# Altium schematic sheet 主控制器.SchDoc
size A3; Organization: Altium Limited; Address1: L3, 12a Rodborough Rd; Address2: Frenchs Forest; Address3: NSW; Address4: Australia 2086
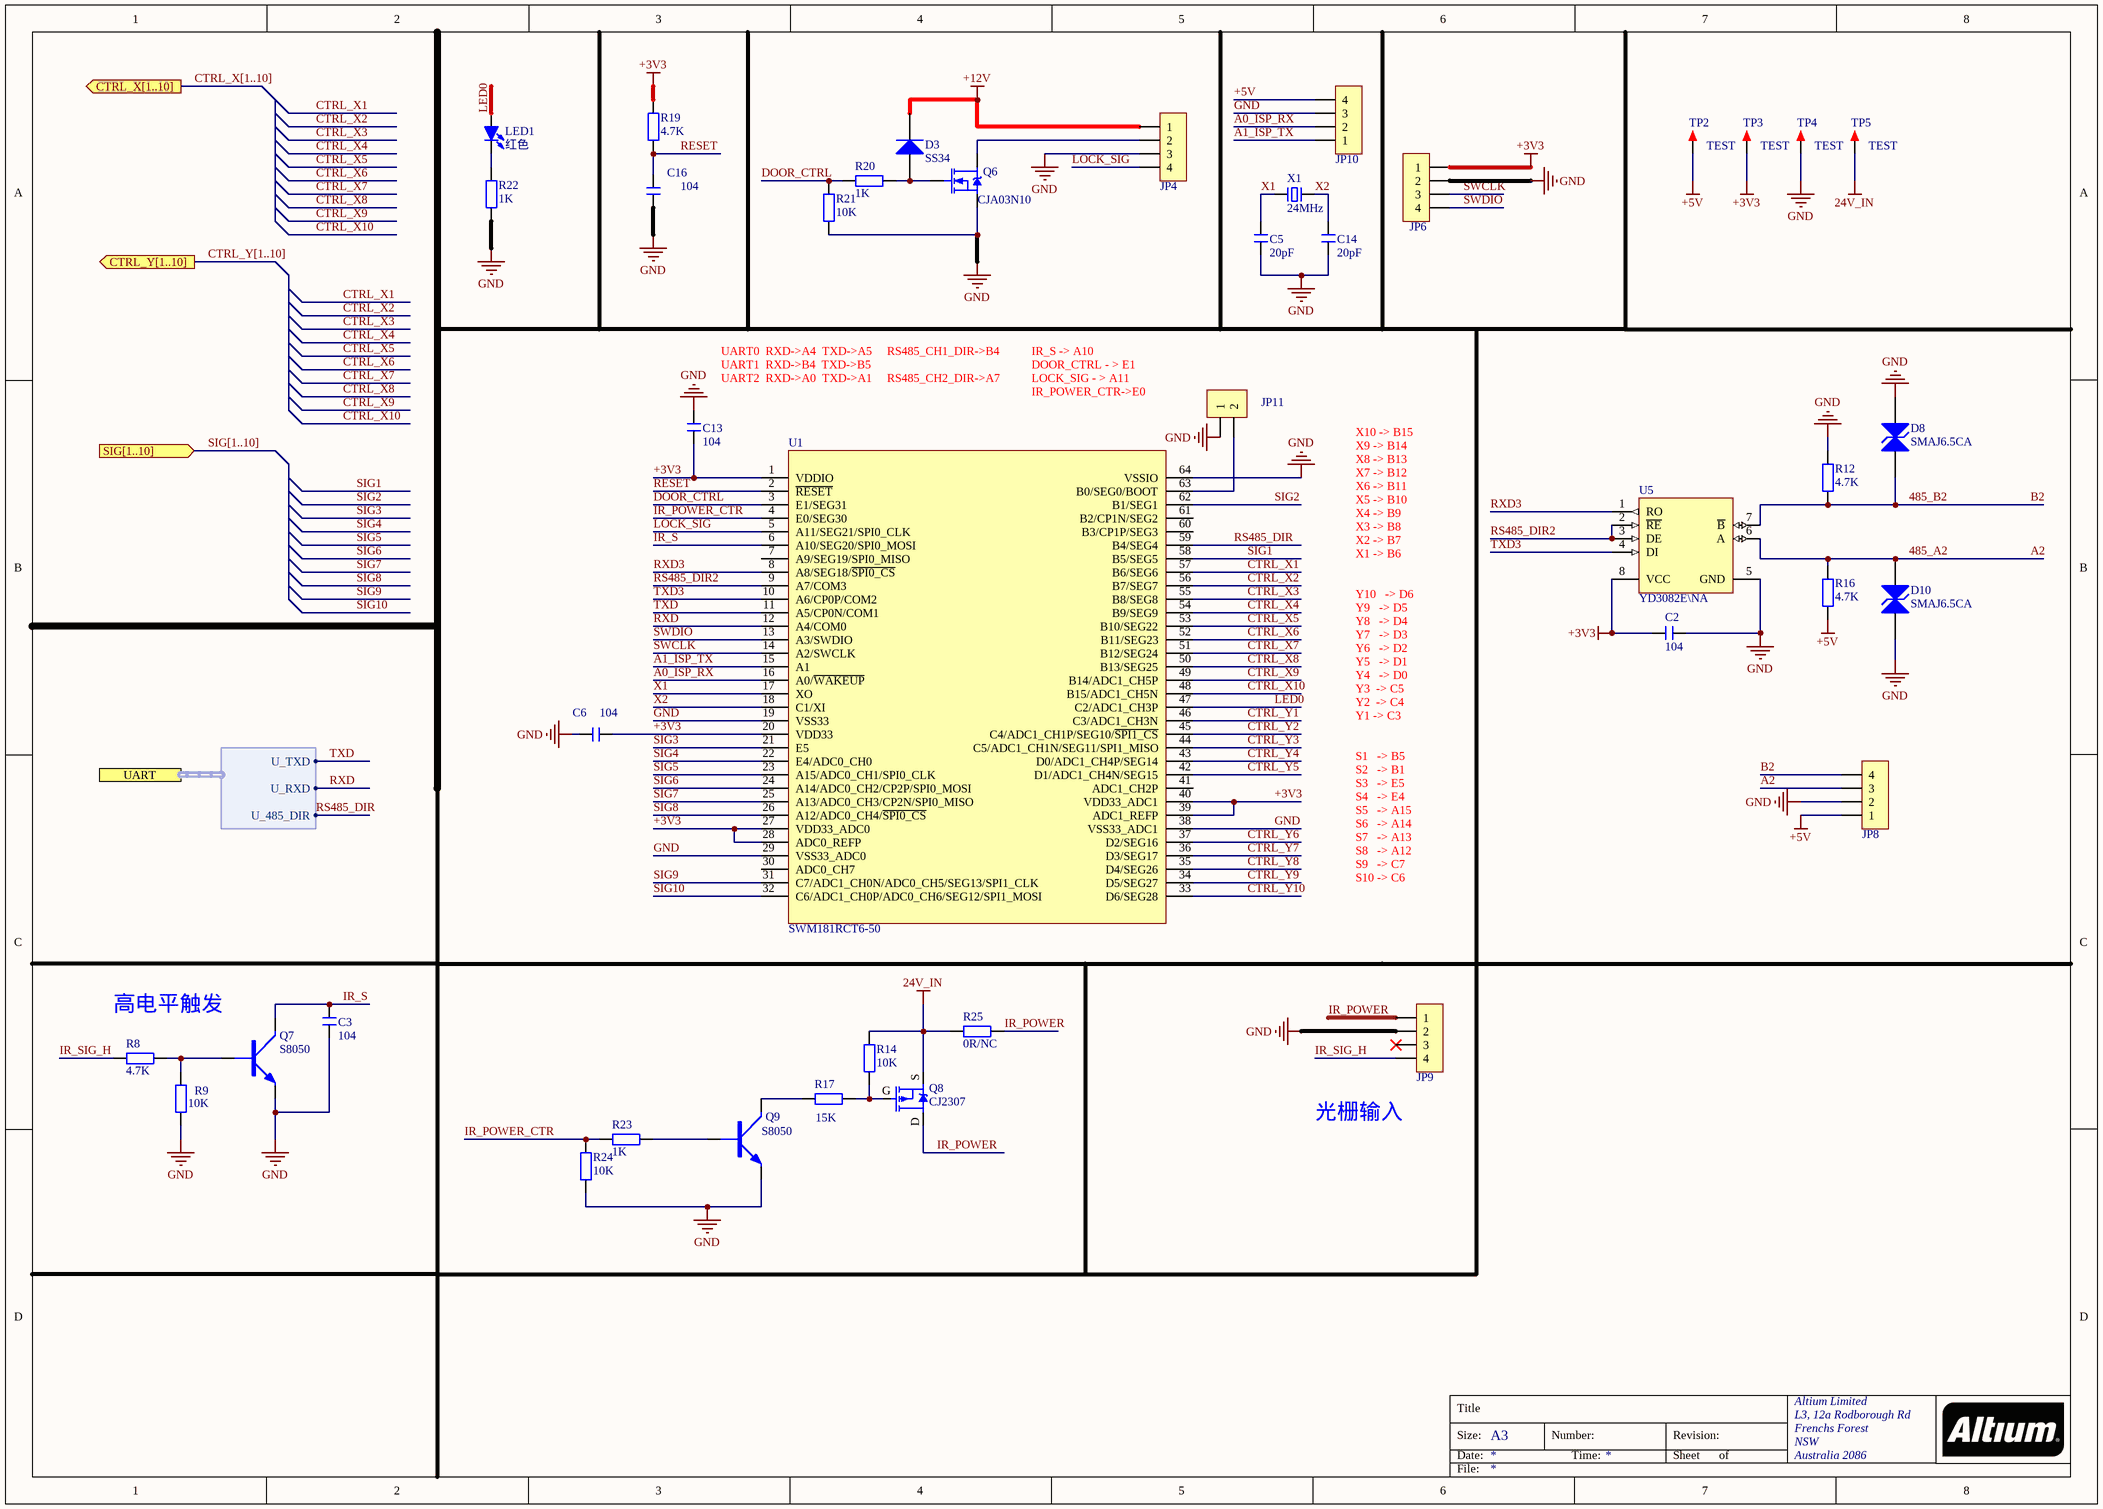
[diagram p0: 主控制器.SchDoc]

## Parts
C2  104  [C 0603]
C3  104  [C 0603]
C5  20pF  [C 0603]
C6  104  [C 0603]
C13  104  [C 0603]
C14  20pF  [C 0603]
C16  104  [C 0603]
D3  SS34  [SMA(DO-214AC)_S1]
D8  SMAJ6.5CA  [SMA(DO-214AC)_S1]
D10  SMAJ6.5CA  [SMA(DO-214AC)_S1]
JP4  XH-2.54-4P  [XH2.54-4P]  (value not drawn)
JP6  HDR-1X4  [HDR-1X4]  (value not drawn)
JP8  XH-2.54-4P  [XH2.54-4P]  (value not drawn)
JP9  HDR-1X4  [XH2.54-4P]  (value not drawn)
JP10  XH-2.54-4P  [XH2.54-4P]  (value not drawn)
JP11  HDR-1X2  [HDR-1X2]  (value not drawn)
LED1  红色  [LED 0603G]
Q6  CJA03N10  [LC-SOT-89(SOT-89-3)]
Q7  S8050  [SOT-23]
Q8  CJ2307  [SOT23]
Q9  S8050  [SOT-23]
R8  4.7K  [R 0603]
R9  10K  [R 0603]
R12  4.7K  [R 0603]
R14  10K  [R 0603]
R16  4.7K  [R 0603]
R17  15K  [R 0603]
R19  4.7K  [R 0603]
R20  1K  [R 0603]
R21  10K  [R 0603]
R22  1K  [R 0603]
R23  1K  [R 0603]
R24  10K  [R 0603]
R25  0R/NC  [R 0603]
TP2  TEST  [TEST 1]
TP3  TEST  [TEST 1]
TP4  TEST  [TEST 1]
TP5  TEST  [TEST 1]
U1  SWM181RCT6-50  [LC-LQFP-64_10x10x05P]
U5  YD3082E\NA  [SOIC-8_150mil]
X1  24MHz  [XTAL-49S SMD]

## Ports
CTRL_X[1..10] (out), CTRL_Y[1..10] (out), SIG[1..10] (in), UART (harness USART)

## Harnesses
USART: U_TXD, U_RXD, U_485_DIR

## Nets
24V_IN: Q8.S R14.2 R25.2 TP5.1
+3V3: C2.1 C6.2 C13.2 JP6.1 R19.2 TP3.1 U1.1(VDDIO) U1.20(VDD33) U1.27(VDD33_ADC0) U1.28(ADC0_REFP) U1.39(ADC1_REFP) U1.40(VDD33_ADC1) U5.8(VCC)
+5V: JP8.1 JP10.4 R16.1 TP2.1
+12V: D3.2(K) JP4.1
GND: C2.2 C3.1 C5.1 C6.1 C13.1 C14.1 C16.2 D8.1(A) D10.1(A) JP4.3 JP6.2 JP8.2 JP9.2 JP10.3 JP11.1 Q6.3(S) Q7.E Q9.E R9.1 R12.2 R21.2 R22.1 R24.2 TP4.1 U1.19(VSS33) U1.29(VSS33_ADC0) U1.38(VSS33_ADC1) U1.64(VSSIO) U5.5(GND)
485_A2: D10.2(K) JP8.3 R16.2 U5.6(A)  [also labelled A2]
485_B2: D8.2(K) JP8.4 R12.1 U5.7(~{B})  [also labelled B2]
A0_ISP_RX: JP10.2 U1.16(A0/~{WAKEUP})
A1_ISP_TX: JP10.1 U1.15(A1)
CTRL_X1: U1.57(B6/SEG6)
CTRL_X2: U1.56(B7/SEG7)
CTRL_X3: U1.55(B8/SEG8)
CTRL_X4: U1.54(B9/SEG9)
CTRL_X5: U1.53(B10/SEG22)
CTRL_X6: U1.52(B11/SEG23)
CTRL_X7: U1.51(B12/SEG24)
CTRL_X8: U1.50(B13/SEG25)
CTRL_X9: U1.49(B14/ADC1_CH5P)
CTRL_X10: U1.48(B15/ADC1_CH5N)
CTRL_Y1: U1.46(C3/ADC1_CH3N)
CTRL_Y2: U1.45(C4/ADC1_CH1P/SEG10/~{SPI1_CS})
CTRL_Y3: U1.44(C5/ADC1_CH1N/SEG11/SPI1_MISO)
CTRL_Y4: U1.43(D0/ADC1_CH4P/SEG14)
CTRL_Y5: U1.42(D1/ADC1_CH4N/SEG15)
CTRL_Y6: U1.37(D2/SEG16)
CTRL_Y7: U1.36(D3/SEG17)
CTRL_Y8: U1.35(D4/SEG26)
CTRL_Y9: U1.34(D5/SEG27)
CTRL_Y10: U1.33(D6/SEG28)
DOOR_CTRL: R20.1 R21.1 U1.3(E1/SEG31)
IR_POWER: JP9.1 Q8.D R25.1
IR_POWER_CTR: R23.1 R24.1 U1.4(E0/SEG30)
IR_S: C3.2 Q7.C U1.6(A10/SEG20/SPI0_MOSI)
IR_SIG_H: JP9.4 R8.2
LED0: LED1.1(A) U1.47(C2/ADC1_CH3P)
LOCK_SIG: JP4.4 U1.5(A11/SEG21/SPI0_CLK)
RESET: C16.1 R19.1 U1.2(~{RESET})
RS485_DIR: U1.59(B4/SEG4) ; port UART.U_485_DIR
RS485_DIR2: U1.9(A7/COM3) U5.2(~{RE}) U5.3(DE)
RXD: U1.12(A4/COM0) ; port UART.U_RXD
RXD3: U1.8(A8/SEG18/~{SPI0_CS}) U5.1(RO)
SIG1: U1.58(B5/SEG5)
SIG2: U1.62(B1/SEG1)
SIG3: U1.21(E5)
SIG4: U1.22(E4/ADC0_CH0)
SIG5: U1.23(A15/ADC0_CH1/SPI0_CLK)
SIG6: U1.24(A14/ADC0_CH2/CP2P/SPI0_MOSI)
SIG7: U1.25(A13/ADC0_CH3/CP2N/SPI0_MISO)
SIG8: U1.26(A12/ADC0_CH4/~{SPI0_CS})
SIG9: U1.31(C7/ADC1_CH0N/ADC0_CH5/SEG13/SPI1_CLK)
SIG10: U1.32(C6/ADC1_CH0P/ADC0_CH6/SEG12/SPI1_MOSI)
SWCLK: JP6.3 U1.14(A2/SWCLK)
SWDIO: JP6.4 U1.13(A3/SWDIO)
TXD: U1.11(A5/CP0N/COM1) ; port UART.U_TXD
TXD3: U1.10(A6/CP0P/COM2) U5.4(DI)
X1: C5.2 U1.17(XO) X1.1
X2: C14.2 U1.18(C1/XI) X1.2
NetD3_1: D3.1(A) Q6.1(G) R20.2
NetJP4_2: JP4.2 Q6.2(D)
NetJP11_2: JP11.2 U1.63(B0/SEG0/BOOT)
NetLED1_2: LED1.2(K) R22.2
NetQ7_B: Q7.B R8.1 R9.2
NetQ8_G: Q8.G R14.1 R17.1
NetQ9_B: Q9.B R23.2
NetQ9_C: Q9.C R17.2

Not connected (* = marked no-connect by the designer): JP9 3*; U1 7(A9/SEG19/SPI0_MISO) 30(ADC0_CH7) 41(ADC1_CH2P) 60(B3/CP1P/SEG3) 61(B2/CP1N/SEG2)

## Buses and harness runs
bus CTRL_X[1..10] = port CTRL_X[1..10]
bus CTRL_Y[1..10] = port CTRL_Y[1..10]
bus SIG[1..10] = port SIG[1..10]

## Notes on the sheet
- (near C13) UART0  RXD->A4  TXD->A5     RS485_CH1_DIR->B4
  UART1  RXD->B4  TXD->B5
  UART2  RXD->A0  TXD->A1     RS485_CH2_DIR->A7
- IR_S -> A10
  DOOR_CTRL - > E1
  LOCK_SIG - > A11
  IR_POWER_CTR->E0
- X10 -> B15
  X9 -> B14
  X8 -> B13
  X7 -> B12
  X6 -> B11
  X5 -> B10
  X4 -> B9
  X3 -> B8
  X2 -> B7
  X1 -> B6
- Y10   -> D6
  Y9   -> D5
  Y8   -> D4
  Y7   -> D3
  Y6   -> D2
  Y5   -> D1
  Y4   -> D0
  Y3  -> C5
  Y2  -> C4
  Y1 -> C3
- S1   -> B5
  S2   -> B1
  S3   -> E5
  S4   -> E4
  S5   -> A15
  S6   -> A14
  S7   -> A13
  S8   -> A12
  S9   -> C7
  S10 -> C6
- (near R8) 高电平触发
- 光栅输入
- Title
- Size:
- Date:
- A3
- Number:
- Time:
- Revision:
- Sheet
- of
- File:

## Library data of the parts
C2 C3 C5 C6 C13 C14 C16 = C: 无极性贴片电容; 版权归属: 源创客; BOM名称: 无极性贴片电容; 学习资源: www.ooocke.com
D3 = SMA(DO-214AC) SS54: 二极管; ComponentLink1Description: 供应商链接; ComponentLink1URL: http://www.szlcsc.com/product/details_23178.html; Package: SMA(DO-214AC); Supplier: LC; SuppliersPartNumber: C22452
D8 D10 = SMB/DO-214AA P6SMB6.8CA: TVS; ComponentLink1Description: 供应商链接; ComponentLink1URL: http://www.szlcsc.com/product/details_79530.html; Package: SMB/DO-214AA; Supplier: LC; SuppliersPartNumber: C78395
JP4 JP6 JP8-JP10 = Header 4: 4P接插件; 版权归属: 源创客; BOM名称: 4P接插件; 学习资源: www.ooocke.com
JP11 = Header 2: 2P接插件; 版权归属: 源创客; BOM名称: 2P接插件; 学习资源: www.ooocke.com
LED1 = LED-SMD: 贴片LED; 版权归属: 源创客; BOM名称: 贴片LED; 学习资源: www.ooocke.com
Q6 = CJA03N10: N沟道场效应管
Q7 Q9 = NPN: NPN三极管
Q8 = P-MOS: P沟道场效应管
R8 R9 R12 R14 R16 R17 R19-R25 = R: 贴片电阻; 版权归属: 源创客; BOM名称: 贴片电阻; 学习资源: www.ooocke.com
TP2-TP5 = TEST: 测试点; 版权归属: 源创客; BOM名称: 测试点; 学习资源: www.ooocke.com
U1 = SWM181RCT6-50: 微控制器, Cortex-M0系列, AA-00
U5 = SP485EEN-L/TR: RS-485/RS-422; ComponentLink1Description: 供应商链接; ComponentLink1URL: http://www.szlcsc.com/product/details_7327.html; Package: SOIC-8; Supplier: LC; SuppliersPartNumber: C6855
X1 = XTAL-2: 2脚晶振; 版权归属: 源创客; BOM名称: 2脚晶振; 学习资源: www.ooocke.com